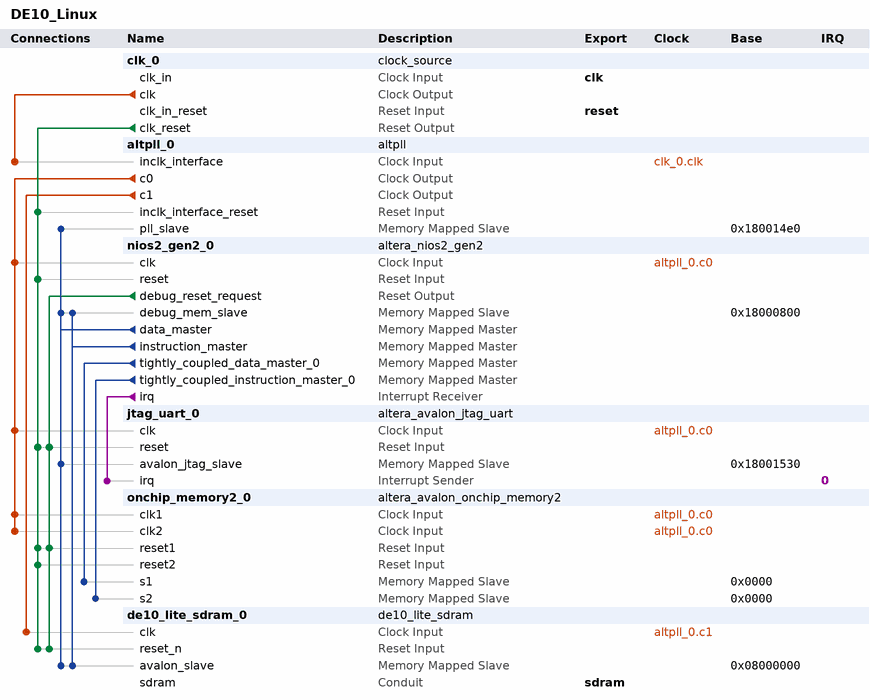
[diagram p0: system contents]
# Platform Designer (Qsys) system DE10_Linux, MAX 10 10M50DAF484C7G
# Parameters at their usual value, and those the tool derives, are not listed.
package require -exact qsys 22.1
create_system DE10_Linux
set_project_property DEVICE_FAMILY {MAX 10}
set_project_property DEVICE 10M50DAF484C7G

add_instance clk_0 clock_source 22.1
set_instance_parameter_value clk_0 clockFrequency 50000000

add_instance altpll_0 altpll 22.1
set_instance_parameter_value altpll_0 CLK0_DIVIDE_BY 1
set_instance_parameter_value altpll_0 CLK0_MULTIPLY_BY 2
set_instance_parameter_value altpll_0 CLK1_DIVIDE_BY 1
set_instance_parameter_value altpll_0 CLK1_DUTY_CYCLE 50
set_instance_parameter_value altpll_0 CLK1_MULTIPLY_BY 2
set_instance_parameter_value altpll_0 CLK1_PHASE_SHIFT -3000
set_instance_parameter_value altpll_0 INCLK0_INPUT_FREQUENCY 20000
set_instance_parameter_value altpll_0 PORT_ARESET PORT_USED
set_instance_parameter_value altpll_0 PORT_LOCKED PORT_USED
set_instance_parameter_value altpll_0 PORT_clk1 PORT_USED
set_instance_parameter_value altpll_0 PORT_clk2 PORT_UNUSED
set_instance_parameter_value altpll_0 PORT_clk3 PORT_UNUSED

add_instance nios2_gen2_0 altera_nios2_gen2 22.1
set_instance_parameter_value nios2_gen2_0 dcache_numTCDM 1
set_instance_parameter_value nios2_gen2_0 dcache_size 32768
set_instance_parameter_value nios2_gen2_0 dividerType srt2
set_instance_parameter_value nios2_gen2_0 exceptionOffset 8192
set_instance_parameter_value nios2_gen2_0 exceptionSlave onchip_memory2_0.s2
set_instance_parameter_value nios2_gen2_0 icache_numTCIM 1
set_instance_parameter_value nios2_gen2_0 icache_size 32768
set_instance_parameter_value nios2_gen2_0 impl Fast
set_instance_parameter_value nios2_gen2_0 mmu_TLBMissExcOffset 16384
set_instance_parameter_value nios2_gen2_0 mmu_TLBMissExcSlave onchip_memory2_0.s2
set_instance_parameter_value nios2_gen2_0 mmu_autoAssignTlbPtrSz false
set_instance_parameter_value nios2_gen2_0 mmu_enabled true
set_instance_parameter_value nios2_gen2_0 resetSlave onchip_memory2_0.s2

add_instance jtag_uart_0 altera_avalon_jtag_uart 22.1
set_instance_parameter_value jtag_uart_0 simInteractiveOptions NO_INTERACTIVE_WINDOWS

add_instance onchip_memory2_0 altera_avalon_onchip_memory2 22.1
set_instance_parameter_value onchip_memory2_0 dataWidth 32
set_instance_parameter_value onchip_memory2_0 dualPort true
set_instance_parameter_value onchip_memory2_0 initMemContent true
set_instance_parameter_value onchip_memory2_0 initializationFileName onchip_mem.hex
set_instance_parameter_value onchip_memory2_0 memorySize 65536

add_instance de10_lite_sdram_0 de10_lite_sdram 1.0

# connections
add_connection altpll_0.c0 jtag_uart_0.clk clock
add_connection altpll_0.c0 nios2_gen2_0.clk clock
add_connection altpll_0.c0 onchip_memory2_0.clk1 clock
add_connection altpll_0.c0 onchip_memory2_0.clk2 clock
add_connection altpll_0.c1 de10_lite_sdram_0.clk clock
add_connection clk_0.clk altpll_0.inclk_interface clock
add_connection clk_0.clk_reset altpll_0.inclk_interface_reset reset
add_connection clk_0.clk_reset de10_lite_sdram_0.reset_n reset
add_connection clk_0.clk_reset jtag_uart_0.reset reset
add_connection clk_0.clk_reset nios2_gen2_0.reset reset
add_connection clk_0.clk_reset onchip_memory2_0.reset1 reset
add_connection clk_0.clk_reset onchip_memory2_0.reset2 reset
add_connection nios2_gen2_0.debug_reset_request de10_lite_sdram_0.reset_n reset
add_connection nios2_gen2_0.debug_reset_request jtag_uart_0.reset reset
add_connection nios2_gen2_0.debug_reset_request onchip_memory2_0.reset1 reset
add_connection nios2_gen2_0.data_master altpll_0.pll_slave avalon
set_connection_parameter_value nios2_gen2_0.data_master/altpll_0.pll_slave baseAddress 0x180014e0
add_connection nios2_gen2_0.data_master de10_lite_sdram_0.avalon_slave avalon
set_connection_parameter_value nios2_gen2_0.data_master/de10_lite_sdram_0.avalon_slave baseAddress 0x08000000
add_connection nios2_gen2_0.data_master jtag_uart_0.avalon_jtag_slave avalon
set_connection_parameter_value nios2_gen2_0.data_master/jtag_uart_0.avalon_jtag_slave baseAddress 0x18001530
add_connection nios2_gen2_0.data_master nios2_gen2_0.debug_mem_slave avalon
set_connection_parameter_value nios2_gen2_0.data_master/nios2_gen2_0.debug_mem_slave baseAddress 0x18000800
add_connection nios2_gen2_0.instruction_master de10_lite_sdram_0.avalon_slave avalon
set_connection_parameter_value nios2_gen2_0.instruction_master/de10_lite_sdram_0.avalon_slave baseAddress 0x08000000
add_connection nios2_gen2_0.instruction_master nios2_gen2_0.debug_mem_slave avalon
set_connection_parameter_value nios2_gen2_0.instruction_master/nios2_gen2_0.debug_mem_slave baseAddress 0x18000800
add_connection nios2_gen2_0.tightly_coupled_data_master_0 onchip_memory2_0.s1 avalon
set_connection_parameter_value nios2_gen2_0.tightly_coupled_data_master_0/onchip_memory2_0.s1 baseAddress 0x0000
add_connection nios2_gen2_0.tightly_coupled_instruction_master_0 onchip_memory2_0.s2 avalon
set_connection_parameter_value nios2_gen2_0.tightly_coupled_instruction_master_0/onchip_memory2_0.s2 baseAddress 0x0000
add_connection nios2_gen2_0.irq jtag_uart_0.irq interrupt
set_connection_parameter_value nios2_gen2_0.irq/jtag_uart_0.irq irqNumber 0

# exported interfaces
add_interface clk clock sink
set_interface_property clk EXPORT_OF clk_0.clk_in
add_interface reset reset sink
set_interface_property reset EXPORT_OF clk_0.clk_in_reset
add_interface sdram conduit end
set_interface_property sdram EXPORT_OF de10_lite_sdram_0.sdram

set_interconnect_requirement {$system} qsys_mm.clockCrossingAdapter HANDSHAKE
set_interconnect_requirement {$system} qsys_mm.enableEccProtection FALSE
set_interconnect_requirement {$system} qsys_mm.insertDefaultSlave FALSE
set_interconnect_requirement {$system} qsys_mm.maxAdditionalLatency 1

save_system DE10_Linux.qsys
